# Altium schematic sheet [03] GSM_GPRS_GPS.SchDoc
size A4
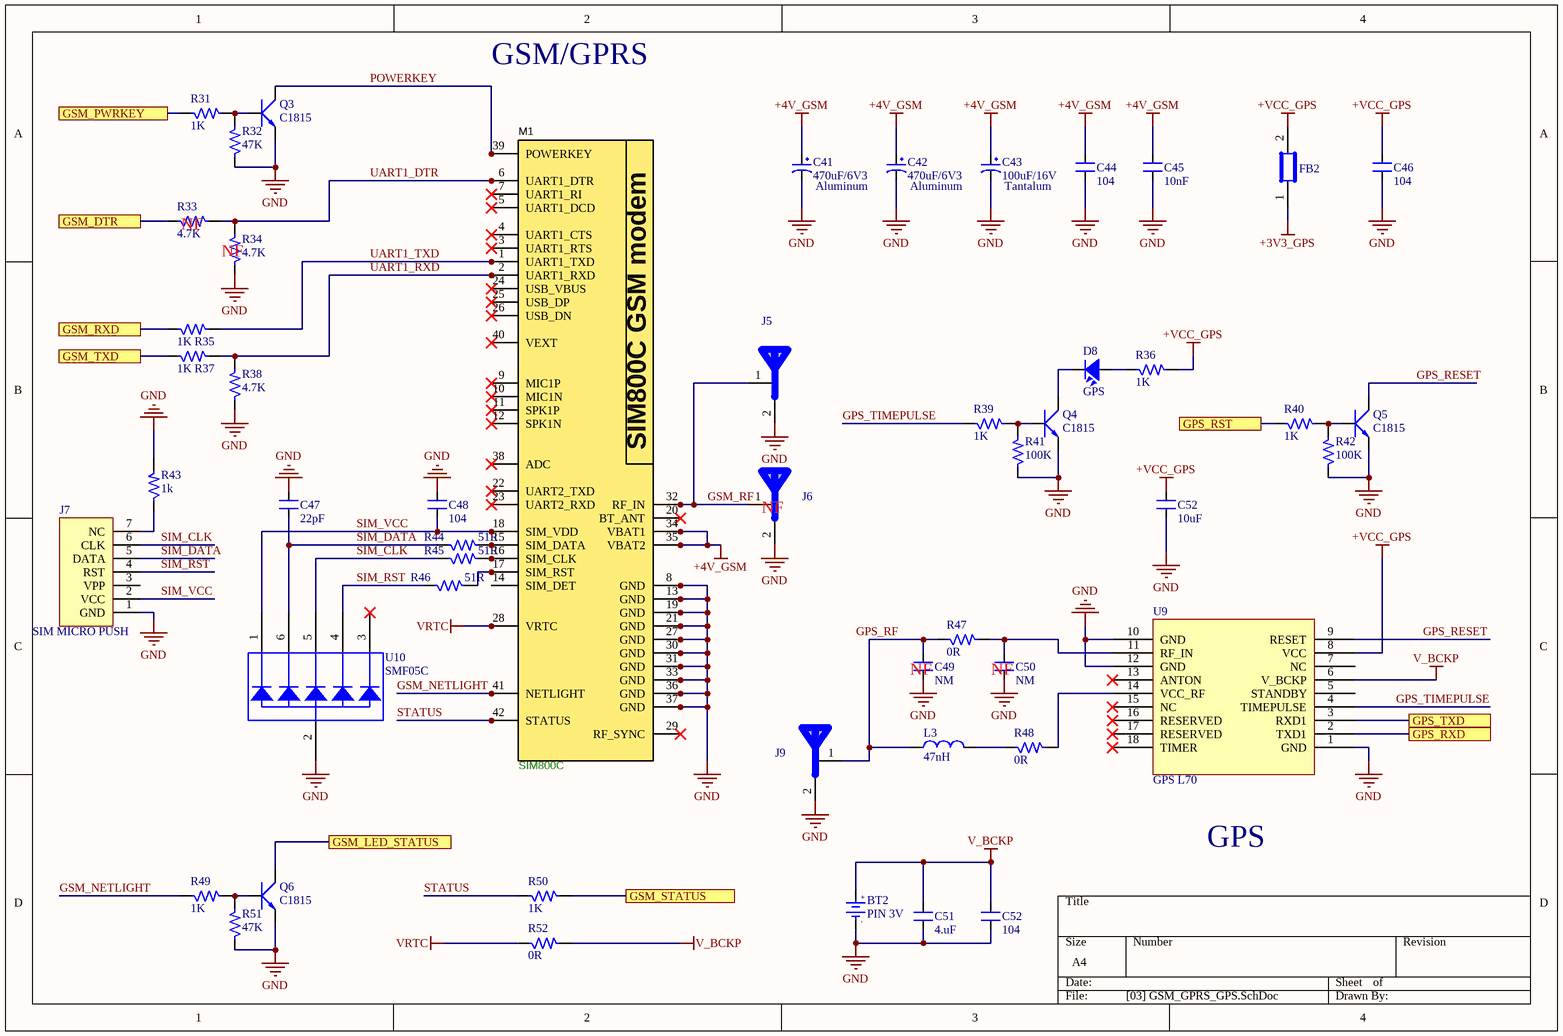
[diagram p0: [03] GSM_GPRS_GPS.SchDoc]

## Parts
(Parts that share a designator on the sheet are numbered #1, #2 ... from top to bottom, then left to right.)
BT2  PIN 3V  [CR1220 SMD]
C41  470uF/6V3  [C_Alu_6.3x7.7]
C42  470uF/6V3  [C_Alu_6.3x7.7]
C43  100uF/16V  [C_7343_40]
C44  104  [CAP_0805]
C45  10nF  [CAP_0805]
C46  104  [CAP_0805]
C47  22pF  [C0603 SMT]
C48  104  [C0603 SMT]
C49  NM  [C0603 SMT]
C50  NM  [C0603 SMT]
C51  4.uF  [SM-1210]
C52#1  10uF  [CAP_0805]
C52#2  104  [CAP_0805]
D8  GPS  [LED-0805-Red]
FB2  BLM21PG600SN1D  [R0805]  (value not drawn)
J5  GPS_ANTENNA  [Antenna-MCX5.08-H5]  (value not drawn)
J6  GSM  [Antenna-IPEX]  (value not drawn)
J7  SIM MICRO PUSH  [MICRO_SIM_HOLDER]
J9  GPS_ANTENNA  [Antenna-MCX5.08-H5]  (value not drawn)
L3  47nH  [C0805]
M1  SIM800C  [SIM800C]
Q3  C1815  [SOT23B]
Q4  C1815  [SOT23B]
Q5  C1815  [SOT23B]
Q6  C1815  [SOT23B]
R31  1K  [R0603 -SMT]
R32  47K  [R0603 -SMT]
R33  4.7K  [R0603 -SMT]
R34  4.7K  [R0603 -SMT]
R35  1K  [R0603 -SMT]
R36  1K  [RES-SMD-0805]
R37  1K  [R0603 -SMT]
R38  4.7K  [R0603 -SMT]
R39  1K  [RES-SMD-0805]
R40  1K  [RES-SMD-0805]
R41  100K  [RES-SMD-0805]
R42  100K  [RES-SMD-0805]
R43  1k  [RES-SMD-0805]
R44  51R  [R0603 -SMT]
R45  51R  [R0603 -SMT]
R46  51R  [R0603 -SMT]
R47  0R  [R0603 -SMT]
R48  0R  [R0603 -SMT]
R49  1K  [R0603 -SMT]
R50  1K  [R0603 -SMT]
R51  47K  [R0603 -SMT]
R52  0R  [RES-SMD-0805]
U9  GPS L70  [GPS L70]
U10  SMF05C  [SOT_363_6]

## Ports
GPS_RST, GPS_RXD, GPS_TXD, GSM_DTR, GSM_LED_STATUS, GSM_PWRKEY, GSM_RXD, GSM_STATUS, GSM_TXD

## Nets
+3V3_GPS: FB2.1
+4V_GSM: C41.1 C42.1 C43.1 C44.1 C45.1 M1.34(VBAT1) M1.35(VBAT2)
+VCC_GPS: C46.2 C52#1.2 FB2.2 R36.2 U9.8(VCC)
GND: BT2.2(GND) C41.2 C42.2 C43.2 C44.2 C45.2 C46.1 C47.2 C48.2 C49.1 C50.1 C51.1 C52#1.1 C52#2.1 J5.2(GND) J6.2(GND) J7.1(GND) J9.2(GND) M1.8(GND) M1.13(GND) M1.19(GND) M1.21(GND) M1.27(GND) M1.30(GND) M1.31(GND) M1.33(GND) M1.36(GND) M1.37(GND) Q3.1(E) Q4.1(E) Q5.1(E) Q6.1(E) R32.1 R34.1 R38.1 R41.1 R42.1 R43.2 R51.1 U9.1(GND) U9.10(GND) U9.12(GND) U10.2(A)
V_BCKP: BT2.1(+3V) C51.2 C52#2.2 R52.2 U9.6(V_BCKP)
VRTC: M1.28(VRTC) R52.1
GPS_RESET: Q5.2(C) U9.9(RESET)
GPS_RST: R40.1 ; port GPS_RST
GPS_RXD: U9.2(TXD1) ; port GPS_RXD
GPS_TIMEPULSE: R39.1 U9.4(TIMEPULSE)
GPS_TXD: U9.3(RXD1) ; port GPS_TXD
GSM_DTR: R33.1 ; port GSM_DTR
GSM_LED_STATUS: Q6.2(C) ; port GSM_LED_STATUS
GSM_NETLIGHT: M1.41(NETLIGHT) R49.1
GSM_PWRKEY: R31.1 ; port GSM_PWRKEY
GSM_RF: J5.1(GND) J6.1(GND) M1.32(RF_IN)
GSM_RXD: R35.1 ; port GSM_RXD
GSM_STATUS: R50.2 ; port GSM_STATUS
GSM_TXD: R37.1 ; port GSM_TXD
POWERKEY: M1.39(POWERKEY) Q3.2(C)
SIM_CLK: J7.6(CLK) R45.1 U10.5(K4)
SIM_DATA: C47.1 J7.5(DATA) R44.1 U10.6(K5)
SIM_RST: J7.4(RST) R46.1 U10.4(K3)
SIM_VCC: C48.1 J7.2(VCC) M1.18(SIM_VDD) U10.1(K1)
STATUS: M1.42(STATUS) R50.1
UART1_DTR: M1.6(UART1_DTR) R33.2 R34.2
UART1_RXD: M1.2(UART1_RXD) R37.2 R38.2
UART1_TXD: M1.1(UART1_TXD) R35.2
NetC49_2: C49.2 J9.1(GND) L3.1 R47.1
NetC50_2: C50.2 R47.2 U9.11(RF_IN)
NetD8_1: D8.1 R36.1
NetD8_2: D8.2 Q4.2(C)
NetJ7_7: J7.7(NC) R43.1
NetL3_2: L3.2 R48.1
NetM1_15: M1.15(SIM_DATA) R44.2
NetM1_16: M1.16(SIM_CLK) R45.2
NetM1_17: M1.17(SIM_RST) R46.2
NetQ3_3: Q3.3(B) R31.2 R32.2
NetQ4_3: Q4.3(B) R39.2 R41.2
NetQ5_3: Q5.3(B) R40.2 R42.2
NetQ6_3: Q6.3(B) R49.2 R51.2
NetR48_2: R48.2 U9.14(VCC_RF)

Not connected (* = marked no-connect by the designer): J7 3(VPP); M1 3(UART1_RTS)* 4(UART1_CTS)* 5(UART1_DCD)* 7(UART1_RI)* 9(MIC1P)* 10(MIC1N)* 11(SPK1P)* 12(SPK1N)* 14(SIM_DET) 20(BT_ANT)* 22(UART2_TXD)* 23(UART2_RXD)* 24(USB_VBUS)* 25(USB_DP)* 26(USB_DN)* 29(RF_SYNC)* 38(ADC)* 40(VEXT)*; U9 5(STANDBY) 7(NC) 13(ANTON)* 15(NC)* 16(RESERVED)* 17(RESERVED)* 18(TIMER)*; U10 3(K2)*

## Notes on the sheet
- GSM/GPRS
- (near R33) NF
- (near C41) Aluminum
- (near C42) Aluminum
- (near C43) Tantalum
- (near R34) NF
- (near J6) NF
- (near C49) NF
- (near C50) NF
- GPS
- Labels drawn without touching a wire or pin: GPS_RF
- (in symbol PIN 3V) +; -
- (in symbol SIM800C) SIM800C GSM modem

## Library data of the parts
BT2 = PIN 3V: Battery 3VDC; Value: PIN 3V
C41 C42 = C-Alu-Tantalum: Cap Aluminum; Value: 10uF/50V; Description 1: 10 => 220uF/6,3V/10V - 10uF => 100uF/16V; Description 2: 0,1uF => 33uF/50V - 10uF => 22uF/63V; Description 3: 0,47uF => 10uF/100V
C43 = C-Alu-Tantalum: Cap Tantalum 7343; Value: 10uF/50V; Description 1: 10 => 220uF/6,3V/10V - 10uF => 100uF/16V; Description 2: 0,1uF => 33uF/50V - 10uF => 22uF/63V; Description 3: 0,47uF => 10uF/100V
C44-C51 C52#1 C52#2 = CM: Cap SMD; Value: 103
D8 = LED: LED Single colour Green and Red; Value: LED 3 ly Single Colour
FB2 = Ferrite Bead
J5 J6 J9 = ANTEN
L3 = L1: Inductor; Value: 150 mH
Q3-Q6 = C1815: NPN 600mW, ECB; Value: C1815
R31 R35-R37 R39 R40 R43 R49 R50 = RM: Resistor SMD; Value: 1K
R32-R34 R38 R41 R42 R44-R48 R51 R52 = RM: Resistor SMD; Value: 1K
U10 = SMF05C: ESD Protection